# EAGLE design KeypadBackpack (EAGLE 5.11)
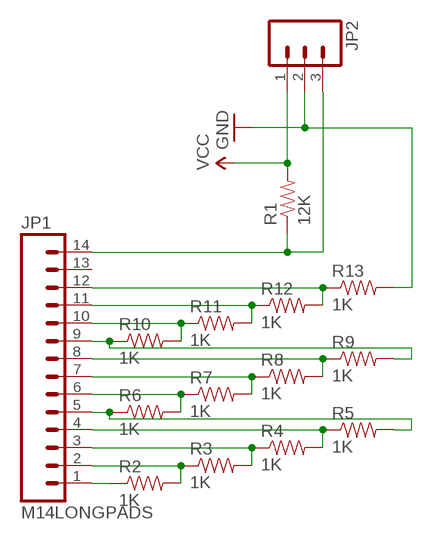
[diagram p0: schematic, sheet 1]

## Parts
JP1  M14LONGPADS  [1X14-LONGPADS]
JP2  M03LONGPADS  [1X03_LONGPADS]
R1  12K  RESISTORAXIAL-0.3  [AXIAL-0.3]
R2  1K  RESISTORAXIAL-0.3  [AXIAL-0.3]
R3  1K  RESISTORAXIAL-0.3  [AXIAL-0.3]
R4  1K  RESISTORAXIAL-0.3  [AXIAL-0.3]
R5  1K  RESISTORAXIAL-0.3  [AXIAL-0.3]
R6  1K  RESISTORAXIAL-0.3  [AXIAL-0.3]
R7  1K  RESISTORAXIAL-0.3  [AXIAL-0.3]
R8  1K  RESISTORAXIAL-0.3  [AXIAL-0.3]
R9  1K  RESISTORAXIAL-0.3  [AXIAL-0.3]
R10  1K  RESISTORAXIAL-0.3  [AXIAL-0.3]
R11  1K  RESISTORAXIAL-0.3  [AXIAL-0.3]
R12  1K  RESISTORAXIAL-0.3  [AXIAL-0.3]
R13  1K  RESISTORAXIAL-0.3  [AXIAL-0.3]

## Nets
A_OUT: JP1.14 JP2.3 R1.P$1
GND: JP2.2 R13.P$2
N$1: JP1.1 R2.P$1
N$2: JP1.2 R2.P$2 R3.P$1
N$3: JP1.3 R3.P$2 R4.P$1
N$4: JP1.4 R4.P$2 R5.P$1
N$5: JP1.5 R5.P$2 R6.P$1
N$6: JP1.6 R6.P$2 R7.P$1
N$7: JP1.7 R7.P$2 R8.P$1
N$8: JP1.10 R10.P$2 R11.P$1
N$9: JP1.8 R8.P$2 R9.P$1
N$10: JP1.9 R9.P$2 R10.P$1
N$11: JP1.11 R11.P$2 R12.P$1
N$12: JP1.12 R12.P$2 R13.P$1
VCC: JP2.1 R1.P$2
Unconnected: JP1.13

## Library data of the parts
JP1 = SparkFun:M14: Header 14 Standard 14-pin 0.1" header. Use with straight break away headers (SKU : PRT-00116), right angle break away headers (PRT-00553), swiss pins (PRT-00743), machine pins (PRT-00117), and female headers (PRT-00115).
JP2 = SparkFun:M03: Header 3 Standard 3-pin 0.1" header. Use with straight break away headers (SKU : PRT-00116), right angle break away headers (PRT-00553), swiss pins (PRT-00743), machine pins (PRT-00117), and female headers (PRT-00115). Molex polarized connector foot print use with SKU : PRT-08232 with associated crimp pins and housings.
R1-R13 = SparkFun:RESISTOR: Resistor Basic schematic elements and footprints for 0603, 1206, and PTH resistors.

## Board
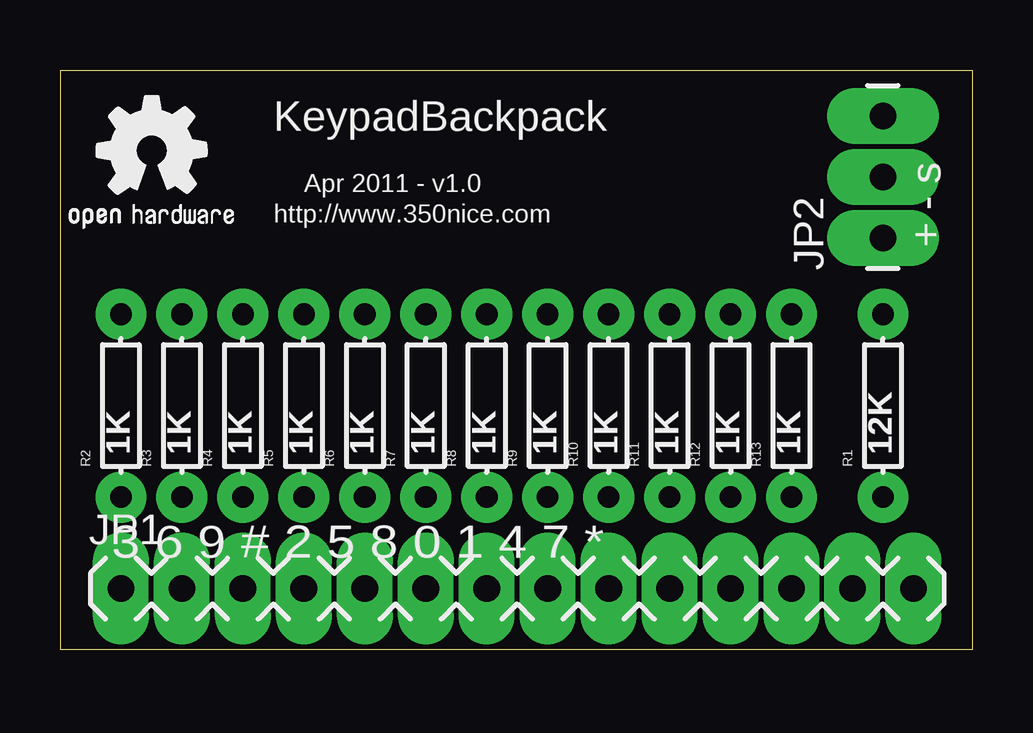
[diagram p1: board, top side]
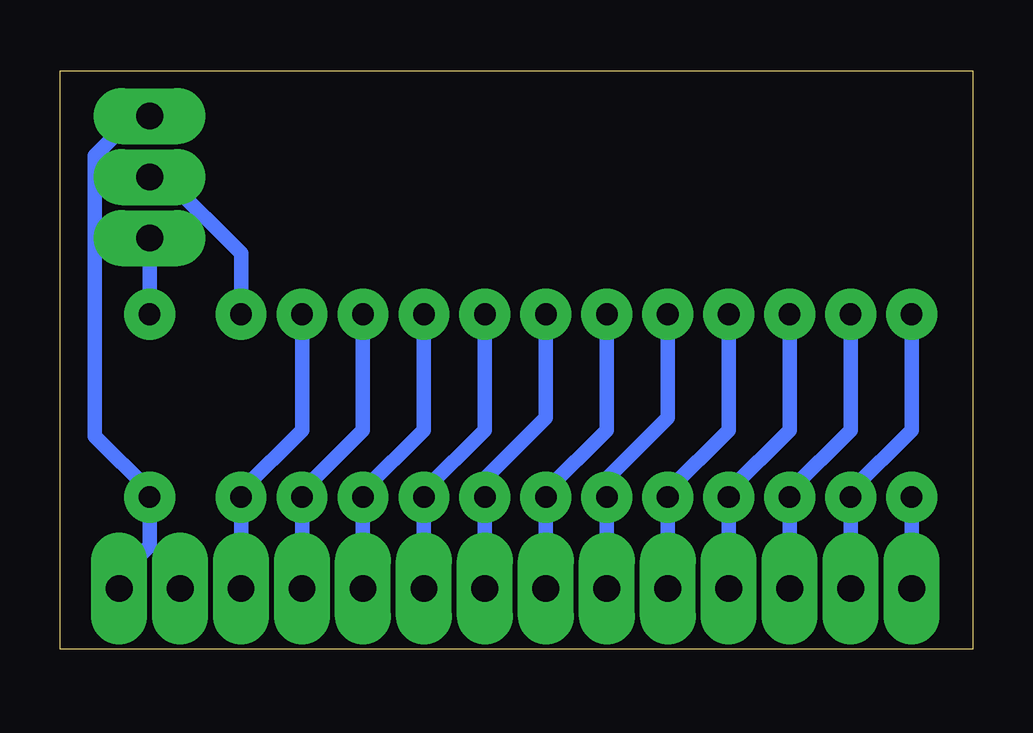
[diagram p2: board, bottom side, seen from below]

Size 38.02 x 24.12 mm. Coordinates in mm from the lower left corner, seen from the top.
Outline: 0,0 38.02,0 38.02,24.12 0,24.12 0,0
Copper layers (1*16): Top 0.035mm / dielectric 1.5mm / Bottom 0.035mm
Design rules "Dek": minimum track width 24mil, minimum drill 24mil, track to track 24mil, track to pad 24mil, pad to pad 18mil, via to via 24mil, smd to smd 8mil, copper to edge 10mil, drill to drill 8mil, minimum pad ring 24mil, minimum via ring 23mil, stop-mask expansion 4mil, vias tented up to drill 25mil, thermal gap 10mil

### Footprints (pad centres in the part's own frame; a part is rotated, then mirrored left to right if it is on the bottom)
1X14-LONGPADS = drill 1.118 long: 1 0,0; 2 2.54,0; 3 5.08,0; 4 7.62,0; 5 10.16,0; 6 12.7,0; 7 15.24,0; 8 17.78,0; 9 20.32,0; 10 22.86,0; 11 25.4,0; 12 27.94,0; 13 30.48,0; 14 33.02,0
1X03_LONGPADS = drill 1.118 pad 1.88 long: 1 0,0; 2 2.54,0; 3 5.08,0
AXIAL-0.3 = drill 0.9 pad 1.88 round: P$1 -3.81,0; P$2 3.81,0

### Placement (x,y rotation side)
JP1  2.54,2.54 0 top
JP2  34.29,17.14 90 top
R1  34.29,10.16 90 top
R2  2.54,10.16 90 top
R3  5.08,10.16 90 top
R4  7.62,10.16 90 top
R5  10.16,10.16 90 top
R6  12.7,10.16 90 top
R7  15.24,10.16 90 top
R8  17.78,10.16 90 top
R9  20.32,10.16 90 top
R10  22.86,10.16 90 top
R11  25.4,10.16 90 top
R12  27.94,10.16 90 top
R13  30.48,10.16 90 top
U$1  [OSHW2]  0,16.51 0 top

### Tracks (layer width: path | path; a pad name or v marks a point on that pad's centre or on a via)
A_OUT
  Bottom 0.61: JP1.14 35.56,3.05 34.29,4.32 R1.P$1 34.29,6.6 36.58,8.89 36.58,20.57 35.05,22.1 34.29,22.1 JP2.3
GND
  Bottom 0.61: R13.P$2 30.48,16.51 33.53,19.56 34.29,19.56 JP2.2
N$1
  Bottom 0.61: JP1.1 R2.P$1
N$2
  Bottom 0.61: JP1.2 R3.P$1 5.08,6.6 2.54,9.14 R2.P$2
N$3
  Bottom 0.61: JP1.3 R4.P$1 7.62,6.6 5.08,9.14 R3.P$2
N$4
  Bottom 0.61: JP1.4 R5.P$1 10.16,6.6 7.62,9.14 R4.P$2
N$5
  Bottom 0.61: JP1.5 R6.P$1 12.7,6.6 10.16,9.14 R5.P$2
N$6
  Bottom 0.61: JP1.6 R7.P$1 15.24,7.11 12.7,9.65 R6.P$2
N$7
  Bottom 0.61: JP1.7 R8.P$1 17.78,6.6 15.24,9.14 R7.P$2
N$8
  Bottom 0.61: JP1.10 R11.P$1 25.4,6.6 22.86,9.14 R10.P$2
N$9
  Bottom 0.61: JP1.8 R9.P$1 20.32,7.11 17.78,9.65 R8.P$2
N$10
  Bottom 0.61: JP1.9 R10.P$1 22.86,6.6 20.32,9.14 R9.P$2
N$11
  Bottom 0.61: JP1.11 R12.P$1 27.94,6.6 25.4,9.14 R11.P$2
N$12
  Bottom 0.61: JP1.12 R13.P$1 30.48,6.6 27.94,9.14 R12.P$2
VCC
  Bottom 0.61: R1.P$2 JP2.1

### Text on the board
tPlace: KeypadBackpack | Apr 2011 - v1.0 | http://www.350nice.com | + - s | 3 6 9 # 2 5 8 0 1 4 7 *